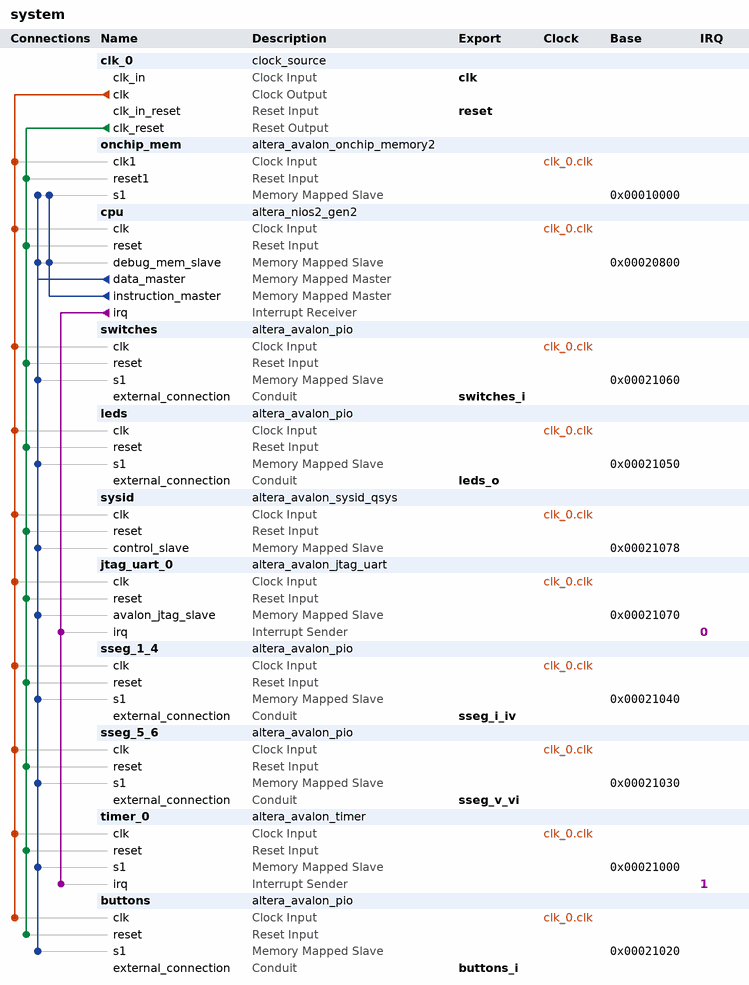
[diagram p0: system contents]
# Platform Designer (Qsys) system system, Cyclone V 5CSEMA5F31C6
# Parameters at their usual value, and those the tool derives, are not listed.
package require -exact qsys 15.1
create_system system
set_project_property DEVICE_FAMILY {Cyclone V}
set_project_property DEVICE 5CSEMA5F31C6

add_instance clk_0 clock_source 15.1
set_instance_parameter_value clk_0 clockFrequency 50000000

add_instance onchip_mem altera_avalon_onchip_memory2 15.1
set_instance_parameter_value onchip_mem dataWidth 64
set_instance_parameter_value onchip_mem dualPort false
set_instance_parameter_value onchip_mem initMemContent true
set_instance_parameter_value onchip_mem initializationFileName onchip_mem.hex
set_instance_parameter_value onchip_mem memorySize 65536

add_instance cpu altera_nios2_gen2 15.1
set_instance_parameter_value cpu dcache_size 2048
set_instance_parameter_value cpu exceptionSlave onchip_mem.s1
set_instance_parameter_value cpu icache_size 4096
set_instance_parameter_value cpu impl Tiny
set_instance_parameter_value cpu resetSlave onchip_mem.s1

add_instance switches altera_avalon_pio 15.1
set_instance_parameter_value switches direction Input
set_instance_parameter_value switches width 10

add_instance leds altera_avalon_pio 15.1
set_instance_parameter_value leds direction Output
set_instance_parameter_value leds width 2

add_instance sysid altera_avalon_sysid_qsys 15.1
set_instance_parameter_value sysid id 1

add_instance jtag_uart_0 altera_avalon_jtag_uart 15.1
set_instance_parameter_value jtag_uart_0 simInteractiveOptions NO_INTERACTIVE_WINDOWS

add_instance sseg_1_4 altera_avalon_pio 15.1
set_instance_parameter_value sseg_1_4 direction Output
set_instance_parameter_value sseg_1_4 width 32

add_instance sseg_5_6 altera_avalon_pio 15.1
set_instance_parameter_value sseg_5_6 direction Output
set_instance_parameter_value sseg_5_6 width 32

add_instance timer_0 altera_avalon_timer 15.1
set_instance_parameter_value timer_0 period 1
set_instance_parameter_value timer_0 periodUnits MSEC

add_instance buttons altera_avalon_pio 15.1
set_instance_parameter_value buttons bitClearingEdgeCapReg true
set_instance_parameter_value buttons captureEdge true
set_instance_parameter_value buttons direction Input
set_instance_parameter_value buttons width 4

# connections
add_connection clk_0.clk buttons.clk clock
add_connection clk_0.clk cpu.clk clock
add_connection clk_0.clk jtag_uart_0.clk clock
add_connection clk_0.clk leds.clk clock
add_connection clk_0.clk onchip_mem.clk1 clock
add_connection clk_0.clk sseg_1_4.clk clock
add_connection clk_0.clk sseg_5_6.clk clock
add_connection clk_0.clk switches.clk clock
add_connection clk_0.clk sysid.clk clock
add_connection clk_0.clk timer_0.clk clock
add_connection clk_0.clk_reset buttons.reset reset
add_connection clk_0.clk_reset cpu.reset reset
add_connection clk_0.clk_reset jtag_uart_0.reset reset
add_connection clk_0.clk_reset leds.reset reset
add_connection clk_0.clk_reset onchip_mem.reset1 reset
add_connection clk_0.clk_reset sseg_1_4.reset reset
add_connection clk_0.clk_reset sseg_5_6.reset reset
add_connection clk_0.clk_reset switches.reset reset
add_connection clk_0.clk_reset sysid.reset reset
add_connection clk_0.clk_reset timer_0.reset reset
add_connection cpu.data_master buttons.s1 avalon
set_connection_parameter_value cpu.data_master/buttons.s1 baseAddress 0x00021020
add_connection cpu.data_master cpu.debug_mem_slave avalon
set_connection_parameter_value cpu.data_master/cpu.debug_mem_slave baseAddress 0x00020800
add_connection cpu.data_master jtag_uart_0.avalon_jtag_slave avalon
set_connection_parameter_value cpu.data_master/jtag_uart_0.avalon_jtag_slave baseAddress 0x00021070
add_connection cpu.data_master leds.s1 avalon
set_connection_parameter_value cpu.data_master/leds.s1 baseAddress 0x00021050
add_connection cpu.data_master onchip_mem.s1 avalon
set_connection_parameter_value cpu.data_master/onchip_mem.s1 baseAddress 0x00010000
add_connection cpu.data_master sseg_1_4.s1 avalon
set_connection_parameter_value cpu.data_master/sseg_1_4.s1 baseAddress 0x00021040
add_connection cpu.data_master sseg_5_6.s1 avalon
set_connection_parameter_value cpu.data_master/sseg_5_6.s1 baseAddress 0x00021030
add_connection cpu.data_master switches.s1 avalon
set_connection_parameter_value cpu.data_master/switches.s1 baseAddress 0x00021060
add_connection cpu.data_master sysid.control_slave avalon
set_connection_parameter_value cpu.data_master/sysid.control_slave baseAddress 0x00021078
add_connection cpu.data_master timer_0.s1 avalon
set_connection_parameter_value cpu.data_master/timer_0.s1 baseAddress 0x00021000
add_connection cpu.instruction_master cpu.debug_mem_slave avalon
set_connection_parameter_value cpu.instruction_master/cpu.debug_mem_slave baseAddress 0x00020800
add_connection cpu.instruction_master onchip_mem.s1 avalon
set_connection_parameter_value cpu.instruction_master/onchip_mem.s1 baseAddress 0x00010000
add_connection cpu.irq jtag_uart_0.irq interrupt
set_connection_parameter_value cpu.irq/jtag_uart_0.irq irqNumber 0
add_connection cpu.irq timer_0.irq interrupt
set_connection_parameter_value cpu.irq/timer_0.irq irqNumber 1

# exported interfaces
add_interface buttons_i conduit end
set_interface_property buttons_i EXPORT_OF buttons.external_connection
add_interface clk clock sink
set_interface_property clk EXPORT_OF clk_0.clk_in
add_interface leds_o conduit end
set_interface_property leds_o EXPORT_OF leds.external_connection
add_interface reset reset sink
set_interface_property reset EXPORT_OF clk_0.clk_in_reset
add_interface sseg_i_iv conduit end
set_interface_property sseg_i_iv EXPORT_OF sseg_1_4.external_connection
add_interface sseg_v_vi conduit end
set_interface_property sseg_v_vi EXPORT_OF sseg_5_6.external_connection
add_interface switches_i conduit end
set_interface_property switches_i EXPORT_OF switches.external_connection

set_interconnect_requirement {$system} qsys_mm.clockCrossingAdapter HANDSHAKE
set_interconnect_requirement {$system} qsys_mm.enableEccProtection FALSE
set_interconnect_requirement {$system} qsys_mm.insertDefaultSlave FALSE
set_interconnect_requirement {$system} qsys_mm.maxAdditionalLatency 1

save_system system.qsys
